# Altium schematic sheet TPSM84824MOL.SchDoc
size A
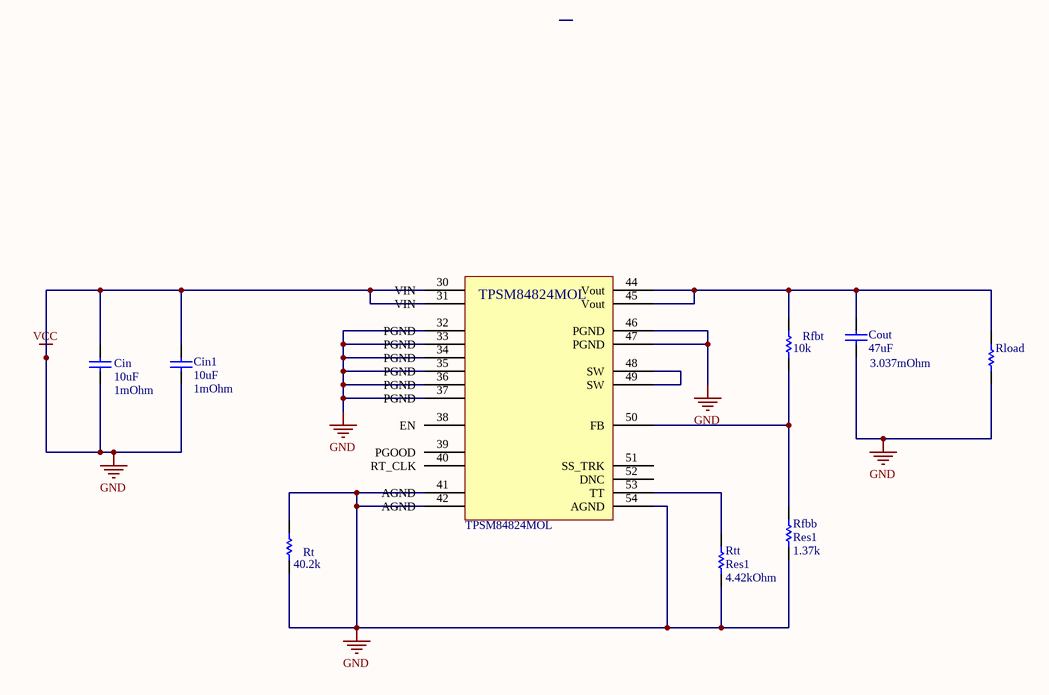
[diagram p0: TPSM84824MOL.SchDoc]

## Parts
Cin  value 10uF  [RAD-0.3]  (hidden comment: Cap)
Cin1  value 10uF  [RAD-0.3]  (hidden comment: Cap)
Cout  value 47uF  res: 3.037mOhm  [RAD-0.3]  (hidden comment: Cap)
Rfbb  Res1  value 1.37k  [AXIAL-0.3]
Rfbt  value 10k  [AXIAL-0.3]  (hidden comment: Res1)
Rload  Res1  [AXIAL-0.3]  (value not drawn)
Rt  value 40.2k  [AXIAL-0.3]  (hidden comment: Res1)
Rtt  Res1  value 4.42kOhm  [AXIAL-0.3]
TPSM84824MOL  TPSM84824MOL  (value not drawn)

## Nets
GND: Cin.1 Cin.2 Cin1.1 Cin1.2 Cout.1 Rfbb.1 Rload.1 Rt.1 Rt.2 Rtt.1 TPSM84824MOL.46(PGND) TPSM84824MOL.47(PGND) TPSM84824MOL.54(AGND)  [also labelled VCC]
NetCout_2: Cout.2 Rfbt.2 Rload.2 TPSM84824MOL.44(Vout) TPSM84824MOL.45(Vout)
NetRfbb_2: Rfbb.2 Rfbt.1 TPSM84824MOL.50(FB)
NetRtt_2: Rtt.2 TPSM84824MOL.53(TT)
NetTPSM84824MOL_48: TPSM84824MOL.48(SW) TPSM84824MOL.49(SW)

Not connected (* = marked no-connect by the designer): TPSM84824MOL 30(VIN) 31(VIN) 32(PGND) 33(PGND) 34(PGND) 35(PGND) 36(PGND) 37(PGND) 38(EN) 39(PGOOD) 40(RT_CLK) 41(AGND) 42(AGND) 51(SS_TRK) 52(DNC)

## Notes on the sheet
- (in symbol Cap) 1mOhm

## Library data of the parts
Cin Cin1 Cout = Cap: Capacitor; Published: 8-Jun-2000; LatestRevisionDate: 17-Jul-2002; LatestRevisionNote: Re-released for DXP Platform.; PackageReference: RAD-0.3; Publisher: Altium Limited; PackageDescription: Radial Cap, Thru-Hole; 2 Leads; 0.3 in Pin Spacing
Rfbb Rfbt Rt Rtt = Res1: Resistor; Published: 8-Jun-2000; LatestRevisionDate: 17-Jul-2002; LatestRevisionNote: Re-released for DXP Platform.; PackageReference: AXIAL-0.3; Publisher: Altium Limited; PackageDescription: Axial Device, Thru-Hole; 2 Leads; 0.3 in Pin Spacing
Rload = Res1: Resistor; Value: 1K; Published: 8-Jun-2000; LatestRevisionDate: 17-Jul-2002; LatestRevisionNote: Re-released for DXP Platform.; PackageReference: AXIAL-0.3; Publisher: Altium Limited; PackageDescription: Axial Device, Thru-Hole; 2 Leads; 0.3 in Pin Spacing